# EasyEDA schematic SCH_Curtain-Opener-try1_2026-10-07.json
TITLE: Sheet_1; REV: 1.0; Date: 2026-10-05; Sheet: 1/1; Drawn By: optmasprime; Company: Your Company
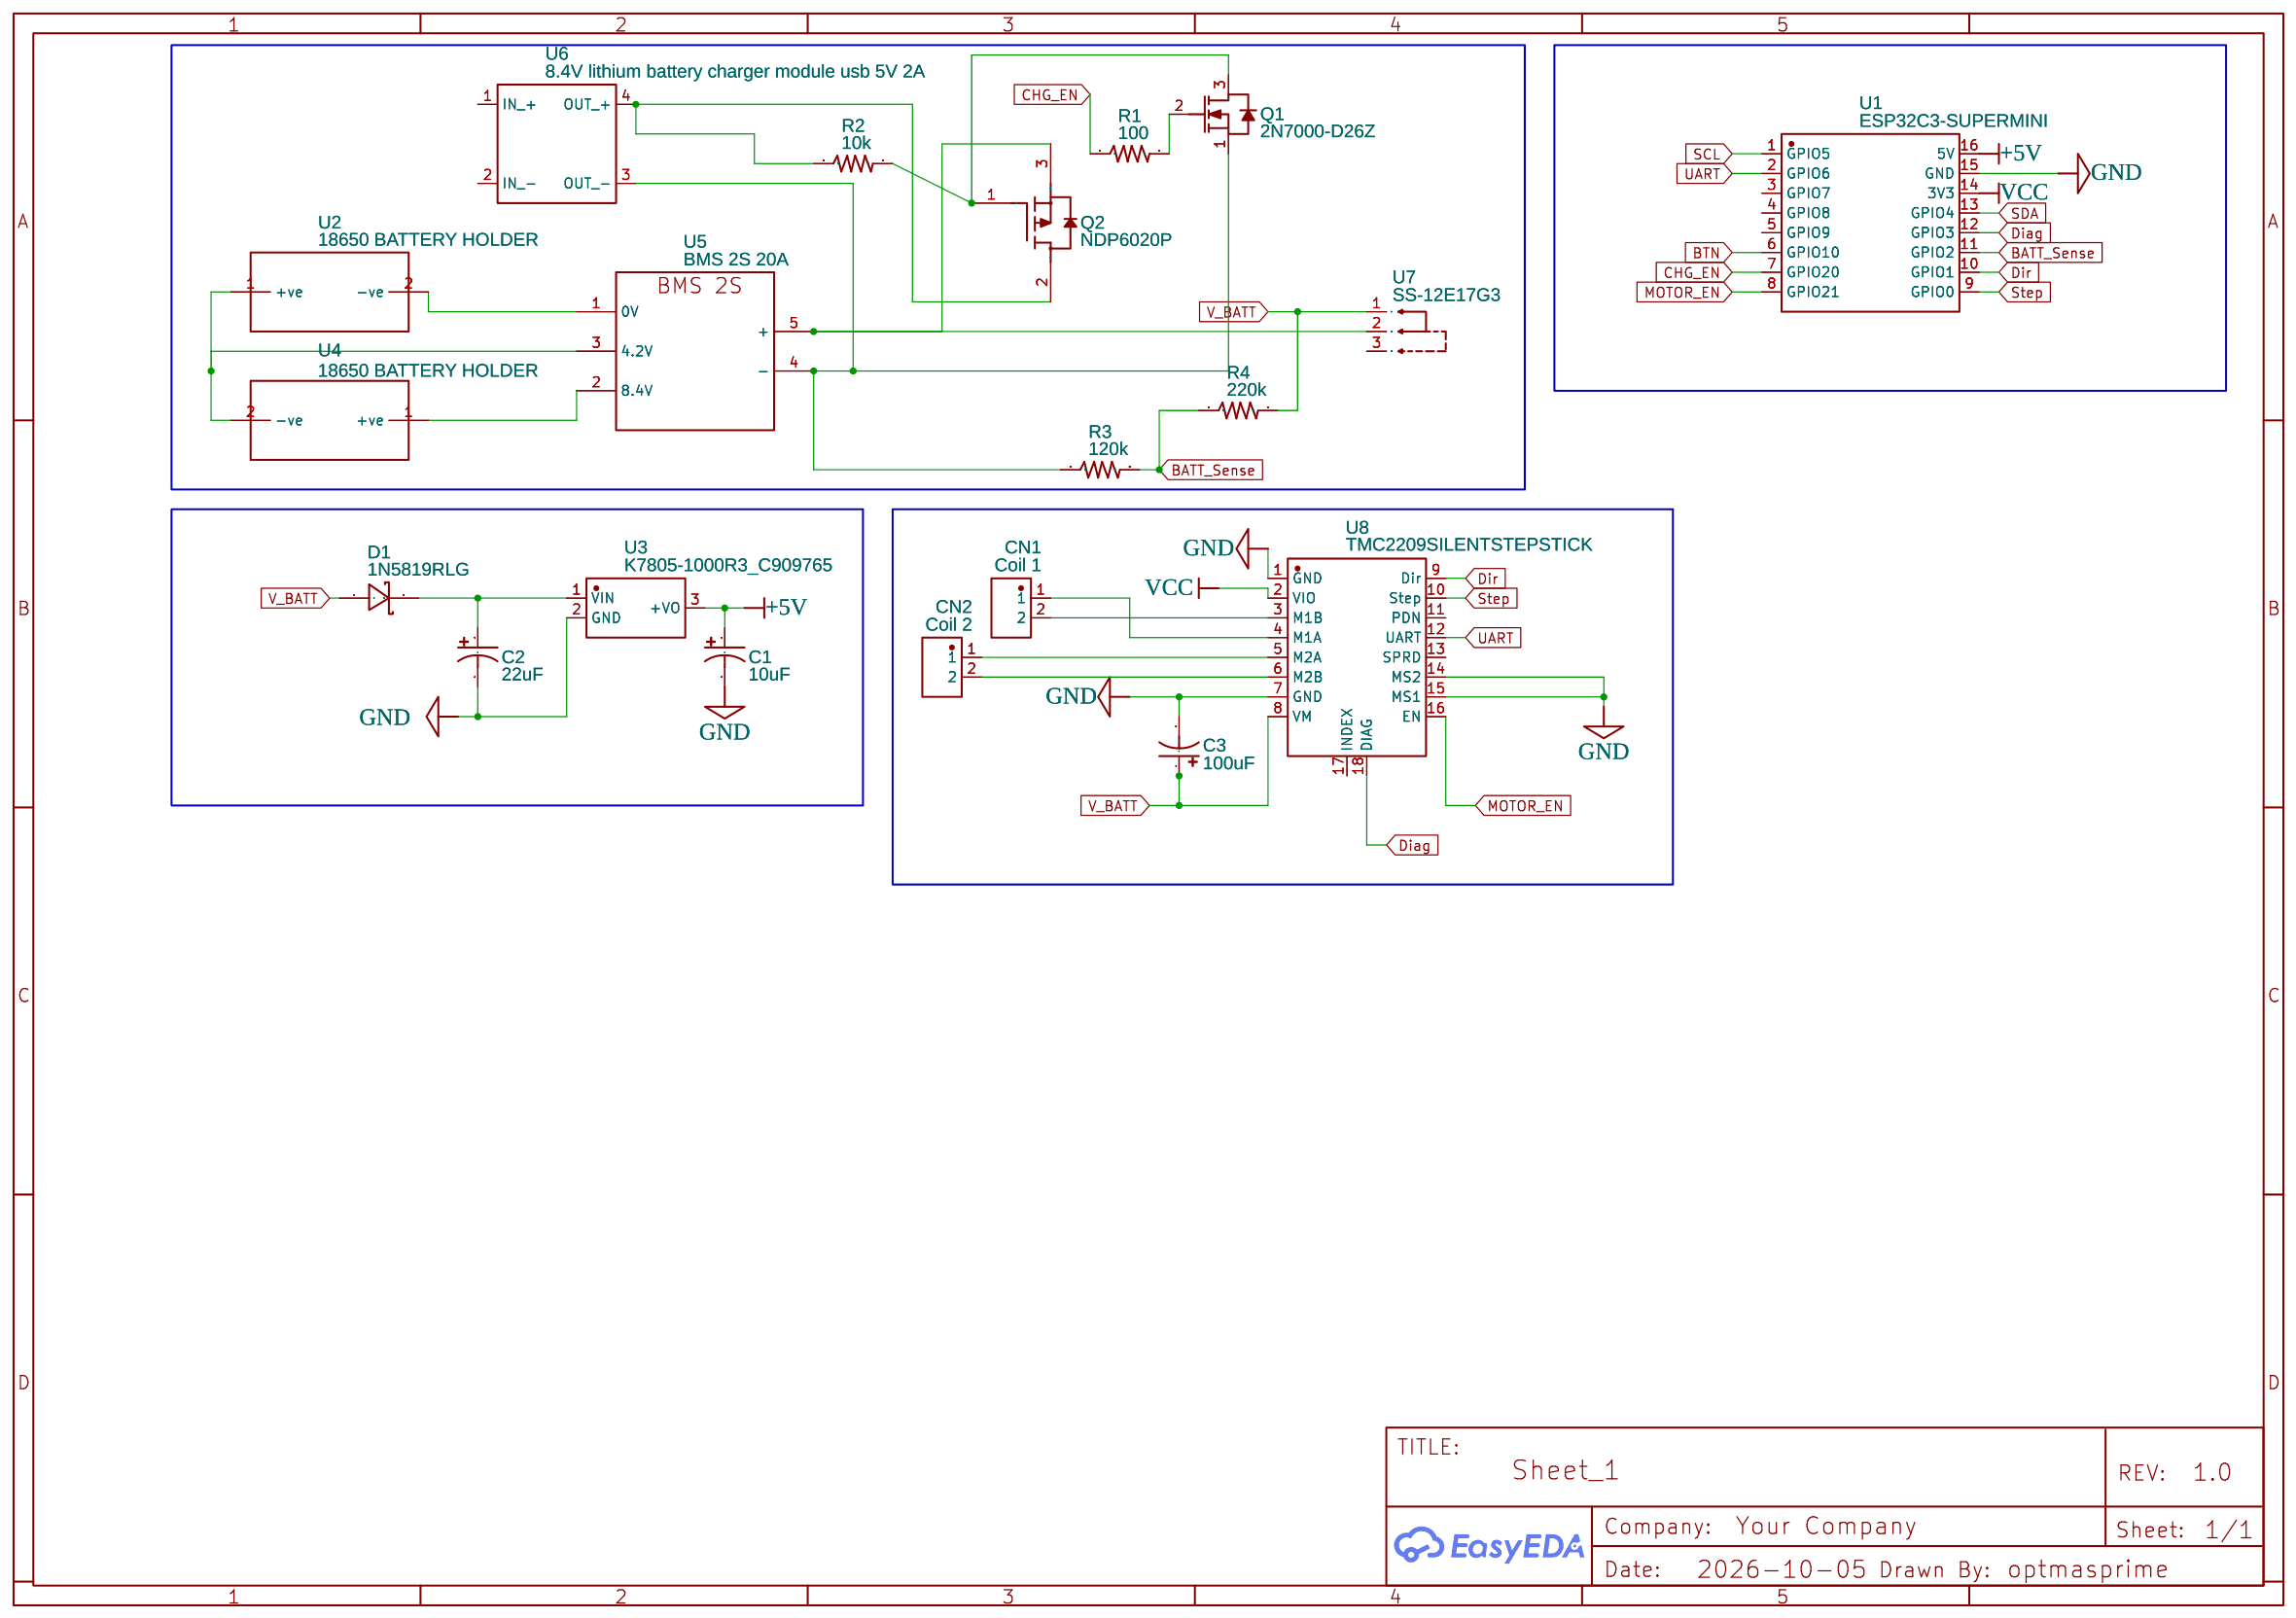
[diagram p0: schematic sheet]

## Parts
C1  10uF  [CPOL-RADIAL-10UF-25V-KIT]
C2  22uF  [CPOL-RADIAL-10UF-25V-KIT]
C3  100uF  [CPOL-RADIAL-10UF-25V-KIT]
CN1  Coil 1  [CONN-TH_MG129-5.08-2P]
CN2  Coil 2  [CONN-TH_MG129-5.08-2P]
D1  1N5819RLG  [DO-41_BD2.4-L4.7-P8.70-D0.9-RD]
Q1  2N7000-D26Z  [TO-92-3_L4.8-W3.7-P2.54-L]
Q2  NDP6020P  [TO-220-3_L10.0-W4.5-P2.54-T]
R1  100  [AXIAL-0.3EZ]
R2  10k  [AXIAL-0.3EZ]
R3  120k  [AXIAL-0.3EZ]
R4  220k  [AXIAL-0.3EZ]
U1  ESP32C3-SUPERMINI  [COMM-SMD_16P-L22.5-W18.0-P2.54-TL]
U2  18650 BATTERY HOLDER  [18650 BATTERY HOLDER CB-18650-PC2]
U3  K7805-1000R3_C909765  [PWRM-TH_K78XX-1000R3]
U4  18650 BATTERY HOLDER  [18650 BATTERY HOLDER CB-18650-PC2]
U5  BMS 2S 20A  [BMS]
U6  8.4V lithium battery charger module usb 5V 2A  [8.4V LITHIUM BATTERY CHARGER MODULE USB 5V 2A]
U7  SS-12E17G3  [SW-TH_HOOYA_SS-12E17G3]
U8  TMC2209SILENTSTEPSTICK  [COMM-TH_TMC2209SILENTSTEPSTICK]

## Library data of the parts
C1-C3 = 10UF-25V-20%(PTH)KIT: CAP-08440; Contributor: SparkFun
CN1 CN2 = MG129-5.08-2P: Contributor: LCSC; Supplier: LCSC; Supplier Part: C2890993; JLCPCB Part Class: Extended Part
D1 = 1N5819RLG: Contributor: LCSC; Supplier: LCSC; Supplier Part: C88393; Manufacturer: onsemi(安森美); JLCPCB Part Class: Extended Part
Q1 = 2N7000-D26Z: Contributor: LCSC; Supplier: LCSC; Supplier Part: C258193; Manufacturer: onsemi(安森美); JLCPCB Part Class: Extended Part
Q2 = NDP6020P: Contributor: LCSC; Supplier: LCSC; Supplier Part: C68561; Manufacturer: onsemi(安森美); JLCPCB Part Class: Extended Part
R1-R4 = 10KOHM-1_4W5%(PTH)HORIZ-KIT: RES-09435; Contributor: SparkFun
U1 = ESP32C3-SUPERMINI: Supplier: LCSC; Supplier Part: C9900147397; Manufacturer: null; Manufacturer Part: ESP32C3-SuperMini; JLCPCB Part Class: Extended Part; Contributor: lcsc
U2 U4 = 18650 BATTERY HOLDER: Contributor: farisabdurrahman02
U3 = K7805-1000R3_C909765: Contributor: LCSC; Supplier: LCSC; Supplier Part: C909765; Manufacturer: DEXU(德旭电子); Manufacturer Part: K7805-1000R3; JLCPCB Part Class: Extended Part
U5 = BMS 2S 20A: Manufacturer Part: BMS 2S 8.4V, 20A; Contributor: a01826551
U6 = 8.4V lithium battery charger module usb 5V 2A: Supplier: LetMeKnow; Contributor: tapana1
U7 = SS-12E17G3: Contributor: lcsc; Supplier: LCSC; Supplier Part: C2939320; Manufacturer: HOOYA(皓宇电子); JLCPCB Part Class: Extended Part
U8 = TMC2209SILENTSTEPSTICK: Supplier: LCSC; Supplier Part: C17375345; Manufacturer: TRINAMIC; JLCPCB Part Class: Extended Part; Contributor: lcsc

## Nets
+5V: C1.1(+) U1.16(5V) U3.3(+VO)
GND: C1.2(-) C2.2(-) C3.2(-) U1.15(GND) U3.2(GND) U8.1(GND) U8.7(GND) U8.14(MS2) U8.15(MS1)
VCC: U1.14(3V3) U8.2(VIO)
BATT_Sense: R3.P$2(2) R4.P$1(1) U1.11(GPIO2)
BTN: U1.6(GPIO10)
CHG_EN: R1.P$1(1) U1.7(GPIO20)
Diag: U1.12(GPIO3) U8.18(DIAG)
Dir: U1.10(GPIO1) U8.9(Dir)
MOTOR_EN: U1.8(GPIO21) U8.16(EN)
SCL: U1.1(GPIO5)
SDA: U1.13(GPIO4)
Step: U1.9(GPIO0) U8.10(Step)
UART: U1.2(GPIO6) U8.12(UART)
V_BATT: C3.1(+) D1.2(A) R4.P$2(2) U7.1 U8.8(VM)
Net-(C2-1): C2.1(+) D1.1(C) U3.1(VIN)
Net-(CN1-1): CN1.1 U8.4(M1A)
Net-(CN1-2): CN1.2 U8.3(M1B)
Net-(CN2-1): CN2.1 U8.5(M2A)
Net-(CN2-2): CN2.2 U8.6(M2B)
Net-(Q1-1): Q1.1(S) R3.P$1(1) U5.4(-) U6.3(OUT -)
Net-(Q1-2): Q1.2(G) R1.P$2(2)
Net-(Q1-3): Q1.3(D) Q2.1(G) R2.P$2(2)
Net-(Q2-2): Q2.2(D) R2.P$1(1) U6.4(OUT +)
Net-(Q2-3): Q2.3(S) U5.5(+) U7.2
Net-(U2-1): U2.1(+ve) U4.2(-ve) U5.3(4.2V)
Net-(U2-2): U2.2(-ve) U5.1(0V)
Net-(U4-1): U4.1(+ve) U5.2(8.4V)

Not connected (* = marked no-connect by the designer): U1 3(GPIO7) 4(GPIO8) 5(GPIO9); U6 1(IN +) 2(IN -); U7 3; U8 11(PDN) 13(SPRD) 17(INDEX)
